# Altium schematic sheet template.SchDoc
size A4
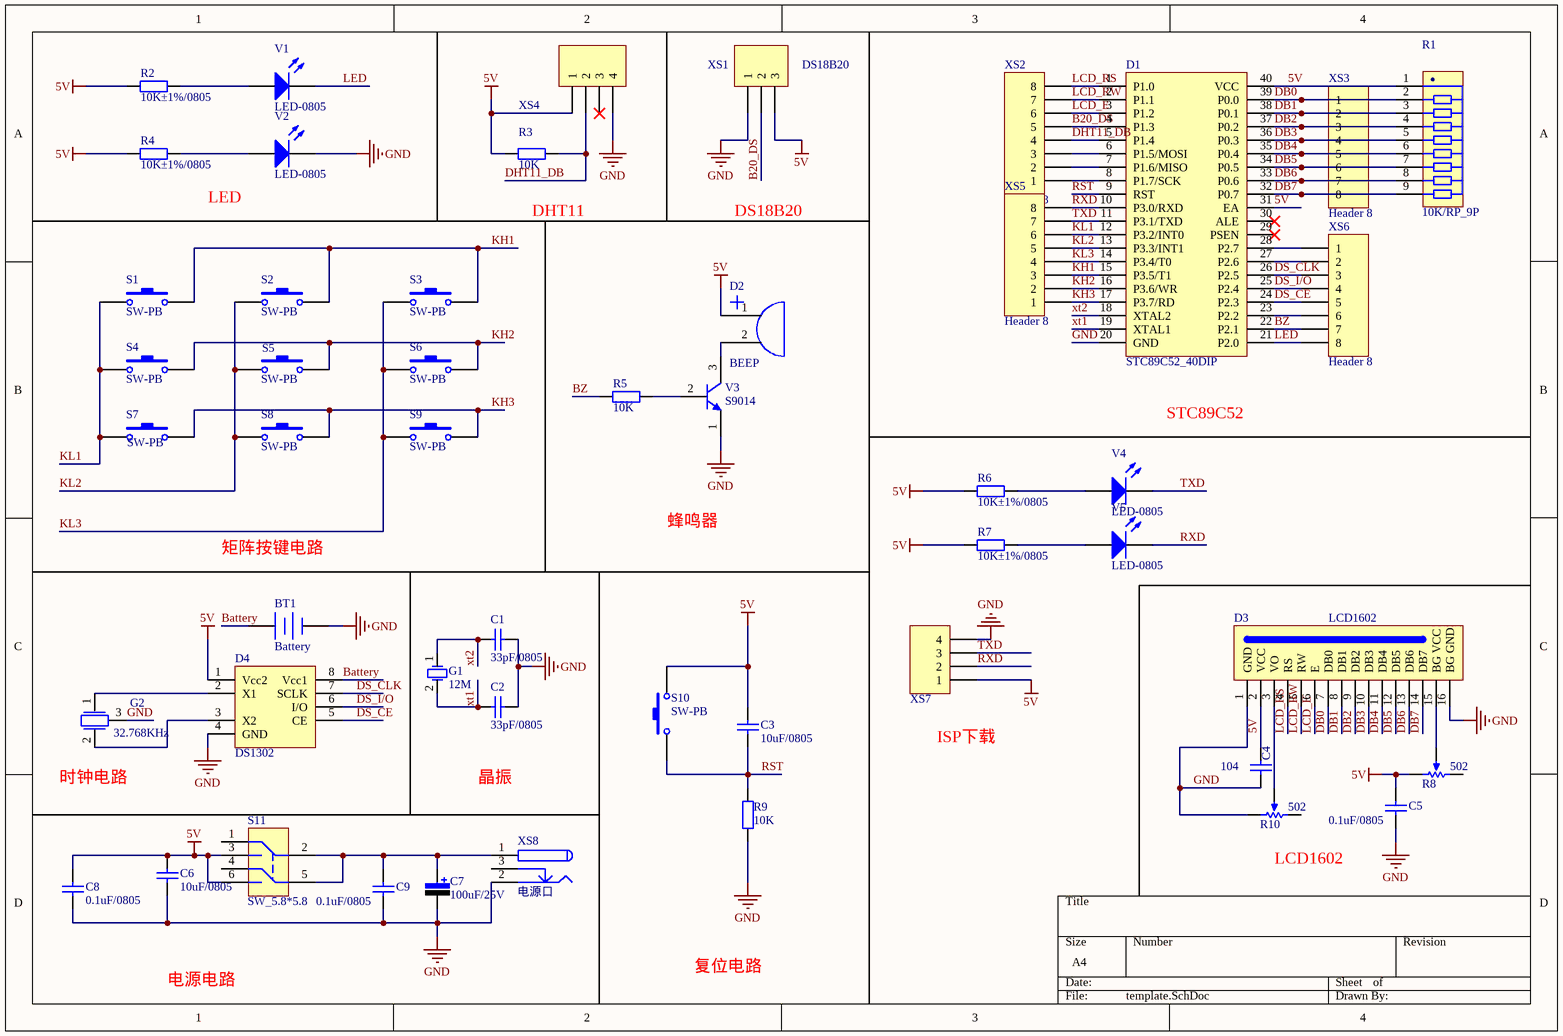
[diagram p0: template.SchDoc]

## Parts
BT1  Battery  [CR1220]
C1  33pF/0805  [C 0805]
C2  33pF/0805  [C 0805]
C3  10uF/0805  [C 0805]
C4  104  [C 0805]
C5  0.1uF/0805  [C 0805]
C6  10uF/0805  [C 0805]
C7  100uF/25V  [C-RB-D6.3]
C8  0.1uF/0805  [C 0805]
C9  0.1uF/0805  [C 0805]
D1  STC89C52_40DIP  [STC89C52底座]
D2  BEEP  [Beep]
D3  LCD1602  [LCD1602接口]
D4  DS1302  [DS1302]
G1  12M  [XTAL-HC-49S]
G2  32.768KHz  [XTAL-TC15]
R1  10K/RP_9P  [RP_9P]
R2  10K±1%/0805  [R 0805]
R3  10K  [R 0805]
R4  10K±1%/0805  [R 0805]
R5  10K  [R 0805]
R6  10K±1%/0805  [R 0805]
R7  10K±1%/0805  [R 0805]
R8  502  [RP]
R9  10K  [R 0805]
R10  502  [RP]
S1  SW-PB  [SW_PB2_A1]
S2  SW-PB  [SW_PB2_A1]
S3  SW-PB  [SW_PB2_A1]
S4  SW-PB  [SW_PB2_A1]
S5  SW-PB  [SW_PB2_A1]
S6  SW-PB  [SW_PB2_A1]
S7  SW-PB  [SW_PB2_A1]
S8  SW-PB  [SW_PB2_A1]
S9  SW-PB  [SW_PB2_A1]
S10  SW-PB  [SW_PB2_A1]
S11  SW_5.8*5.8  [SW-5.8]
V1  LED-0805  [LED-0805]
V2  LED-0805  [LED-0805]
V3  S9014  [SS9014]
V4  LED-0805  [LED-0805]
V5  LED-0805  [LED-0805]
XS1  DS18B20  [HDR3X1_A]
XS2  Header 8  [HDR8X1_A]
XS3  Header 8  [HDR8X1_A]
XS4  Header 4  [HDR4X1_A]  (value not drawn)
XS5  Header 8  [HDR8X1_A]
XS6  Header 8  [HDR8X1_A]
XS7  Header 4  [HDR4X1_A]  (value not drawn)
XS8  电源口  [DC-005]

## Nets
5V: C3.2 C4.2 C5.2 C6.2 C8.2 D1.31(EA) D1.40(VCC) D2.1 D3.2(VCC) D4.1(Vcc2) R1.1 R2.1 R3.1 R4.1 R6.1 R7.1 R8.3(BOT) S10.2 S11.3 S11.6 XS1.3 XS4.1 XS7.1
GND: BT1.2(-) C1.2 C2.1 C4.1 C5.1 C6.1 C7.2 C8.1 C9.1 D1.20(GND) D3.1(GND) D3.16(BG_GND) D4.4(GND) G2.3 R9.1 R10.3(BOT) V2.2(K) V3.1(E) XS1.1 XS4.4 XS7.4 XS8.2
B20_DS: D1.4(P1.3) XS1.2 XS2.5
Battery: BT1.1(+) D4.8(Vcc1)
BZ: D1.22(P2.1) R5.1 XS6.7
DB0: D1.39(P0.0) D3.7(DB0) R1.2 XS3.1
DB1: D1.38(P0.1) D3.8(DB1) R1.3 XS3.2
DB2: D1.37(P0.2) D3.9(DB2) R1.4 XS3.3
DB3: D1.36(P0.3) D3.10(DB3) R1.5 XS3.4
DB4: D1.35(P0.4) D3.11(DB4) R1.6 XS3.5
DB5: D1.34(P0.5) D3.12(DB5) R1.7 XS3.6
DB6: D1.33(P0.6) D3.13(DB6) R1.8 XS3.7
DB7: D1.32(P0.7) D3.14(DB7) R1.9 XS3.8
DHT11_DB: D1.5(P1.4) R3.2 XS2.4 XS4.2
DS_CE: D1.24(P2.3) D4.5(CE) XS6.5
DS_CLK: D1.26(P2.5) D4.7(SCLK) XS6.3
DS_I/O: D1.25(P2.4) D4.6(I/O) XS6.4
KH1: D1.15(P3.5/T1) S1.2 S2.2 S3.2 XS5.3
KH2: D1.16(P3.6/WR) S4.2 S5.2 S6.2 XS5.2
KH3: D1.17(P3.7/RD) S7.2 S8.2 S9.2 XS5.1
KL1: D1.12(P3.2/INT0) S1.1 S4.1 S7.1 XS5.6
KL2: D1.13(P3.3/INT1) S2.1 S5.1 S8.1 XS5.5
KL3: D1.14(P3.4/T0) S3.1 S6.1 S9.1 XS5.4
LCD_E: D1.3(P1.2) D3.6(E) XS2.6
LCD_RS: D1.1(P1.0) D3.4(RS) XS2.8
LCD_RW: D1.2(P1.1) D3.5(RW) XS2.7
LED: D1.21(P2.0) V1.2(K) XS6.8
RST: C3.1 D1.9(RST) R9.2 S10.1
RXD: D1.10(P3.0/RXD) V5.2(K) XS5.8 XS7.2
TXD: D1.11(P3.1/TXD) V4.2(K) XS5.7 XS7.3
xt1: C2.2 D1.19(XTAL1) G1.2
xt2: C1.1 D1.18(XTAL2) G1.1
NetC7_1: C7.1 C9.2 S11.2 S11.5 XS8.1
NetD1_6: D1.6(P1.5/MOSI) XS2.3
NetD1_7: D1.7(P1.6/MISO) XS2.2
NetD1_8: D1.8(P1.7/SCK) XS2.1
NetD1_23: D1.23(P2.2) XS6.6
NetD1_27: D1.27(P2.6) XS6.2
NetD1_28: D1.28(P2.7) XS6.1
NetD2_2: D2.2 V3.3(C)
NetD3_3: D3.3(VO) R10.2(TAP)
NetD3_15: D3.15(BG_VCC) R8.2(TAP)
NetD4_2: D4.2(X1) G2.1
NetD4_3: D4.3(X2) G2.2
NetR2_2: R2.2 V1.1(A)
NetR4_2: R4.2 V2.1(A)
NetR5_2: R5.2 V3.2(B)
NetR6_2: R6.2 V4.1(A)
NetR7_2: R7.2 V5.1(A)

Not connected (* = marked no-connect by the designer): D1 29(PSEN)* 30(ALE)*; R8 1(TOP); R10 1(TOP); S11 1 4; XS4 3*; XS8 3

## Notes on the sheet
- LED
- (near R3) DHT11
- DS18B20
- STC89C52
- 矩阵按键电路
- 蜂鸣器
- (near G2) 时钟电路
- 晶振
- (near XS7) ISP下载
- (near R10) LCD1602
- 电源电路
- 复位电路
- (in symbol RP_9P) .

## Library data of the parts
BT1 = Battery: 备份电池; Published: 24-Mar-1999; LatestRevisionDate: 17-Jul-2002; LatestRevisionNote: Re-released for DXP Platform.; PackageReference: BAT-2; Publisher: Altium Limited
C1-C6 C8 C9 = Cap1: 无极性贴片电容; Published: 8-Jun-2000; LatestRevisionDate: 17-Jul-2002; LatestRevisionNote: Re-released for DXP Platform.; PackageReference: RAD-0.3; Publisher: Altium Limited
  C1 C2: Value: 33pF/0805
  C3 C6: Value: 10uF/0805
  C4: Value: 104
  C5 C8 C9: Value: 0.1uF/0805
C7 = Cap Pol2: 贴片极性电解电容; Vol: 16V; Published: 8-Jun-2000; LatestRevisionDate: 17-Jul-2002; LatestRevisionNote: Re-released for DXP Platform.; PackageReference: RB7.6-15; Publisher: Altium Limited; Value: 100uF/25V
D1 = STC89C52_40DIP: 40 DIP
D2 = BEEP: 蜂鸣器; TYPE: beep
D3 = LCD1602接口: LCD1602接口，16P; TYPE: LCD1602接口
D4 = DS1302: 实时时钟芯片; TYPE: DS1302
G1 = XTAL-2P: 2脚晶振; Published: 8-Jun-2000; LatestRevisionDate: 17-Jul-2002; LatestRevisionNote: Re-released for DXP Platform.; PackageReference: R38; Publisher: Altium Limited; Value: 12M
G2 = XTAL-3P: 3脚晶振; TYPE: XTAL-3PIN; value: 32.768KHz
R1 = RP_9P: 9P排阻; Value: 10K/RP_9P
R2 R4 R6 R7 = Res1: 贴片电阻; Published: 8-Jun-2000; LatestRevisionDate: 17-Jul-2002; LatestRevisionNote: Re-released for DXP Platform.; PackageReference: AXIAL-0.4; Publisher: Altium Limited; Value: 10K±1%/0805
R3 R5 R9 = Res1: 贴片电阻; Value: 10K±1%/0805; Published: 8-Jun-2000; LatestRevisionDate: 17-Jul-2002; LatestRevisionNote: Re-released for DXP Platform.; PackageReference: AXIAL-0.4; Publisher: Altium Limited
R8 R10 = RPot: 精密可调电阻; Sim Note: Enter the Resistance value and the set point into parameter fields.; Set Position: 0.5; Value: 10K/RP; Published: 8-Jun-2000; LatestRevisionDate: 17-Jul-2002; LatestRevisionNote: Re-released for DXP Platform.; PackageReference: VR5; Publisher: Altium Limited
S1-S10 = SW-PB: 微动开关; Published: 24-Mar-1999; LatestRevisionDate: 17-Jul-2002; LatestRevisionNote: Re-released for DXP Platform.; PackageReference: SPST-2; Publisher: Altium Limited; TYPE: SW-PB
S11 = SW-6脚自锁开关: 6脚自锁开关; TYPE: SW_5.8*5.8
V1 V2 V4 V5 = LED0: 发光二极管; Published: 8-Jun-2000; LatestRevisionDate: 08-Jul-2005; LatestRevisionNote: Mech Layer 1 removed.; PackageReference: LED-0; Publisher: Altium Limited; TYPE: LED-0805
V3 = S9014: NPN三极管; Published: 8-Jun-2000; LatestRevisionDate: 15-Jan-2003; LatestRevisionNote: PCB Footprint 'BCY-W3/D4.7' replaced; DatasheetDocument: 1997; PackageDocument: Sep-1998; PackageReference: TO-92A; Publisher: Altium Limited; Code_JEDEC: TO-92A; ComponentLink1Description: Manufacturer Link; ComponentLink1URL: http://www.fairchildsemi.com/; ComponentLink2Description: Datasheet; ComponentLink2URL: http://www.fairchildsemi.com/ds/2N%2F2N3904.pdf; TYPE: S9014
XS1 = Header 3: 接插件; LatestRevisionDate: 17-Jul-2002; LatestRevisionNote: Re-released for DXP Platform.; Publisher: Altium Limited; TYPE: Header 3
XS2 XS3 XS5 XS6 = Header 8: Header, 8-Pin; LatestRevisionDate: 17-Jul-2002; LatestRevisionNote: Re-released for DXP Platform.; Publisher: Altium Limited; TYPE: Header 8
XS4 XS7 = Header 4: 接插件; LatestRevisionDate: 17-Jul-2002; LatestRevisionNote: Re-released for DXP Platform.; Publisher: Altium Limited; TYPE: Header 4
XS8 = DC connector: 直流电源端子; Published: 17-Dec-2003; DatasheetDocument: 09-May-2002; Publisher: Altium Limited; ComponentLink1Description: Manufacturer Link; ComponentLink1URL: http://domino.kycon.com/internet/Products.html; TYPE: DC005